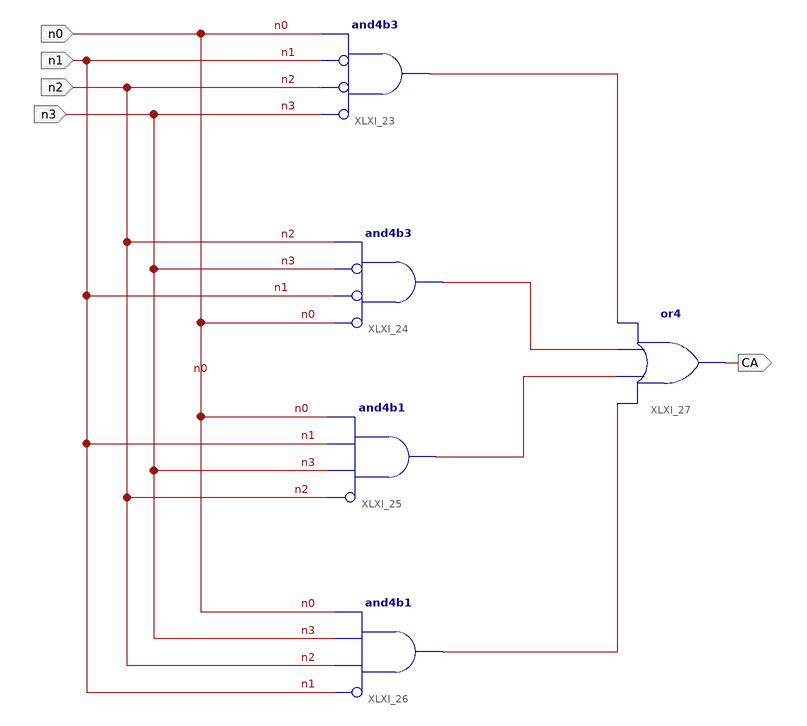
[diagram p0: schematic sheet 1]
// Xilinx ISE schematic A.sch (spartan3e) as structural Verilog: 5 symbols, 5 ports
module A (
  input  n0,
  input  n2,
  input  n3,
  input  n1,
  output CA
);

  wire XLXN_12, XLXN_13, XLXN_14, XLXN_15;

  and XLXI_23 (XLXN_12, ~n3, ~n2, ~n1, n0);  // and4b3
  and XLXI_24 (XLXN_13, ~n0, ~n1, ~n3, n2);  // and4b3
  and XLXI_25 (XLXN_14, ~n2, n3, n1, n0);  // and4b1
  and XLXI_26 (XLXN_15, ~n1, n2, n3, n0);  // and4b1
  or XLXI_27 (CA, XLXN_15, XLXN_14, XLXN_13, XLXN_12);
endmodule
